# EAGLE design powerboard_monitor (EAGLE 8.4.3)
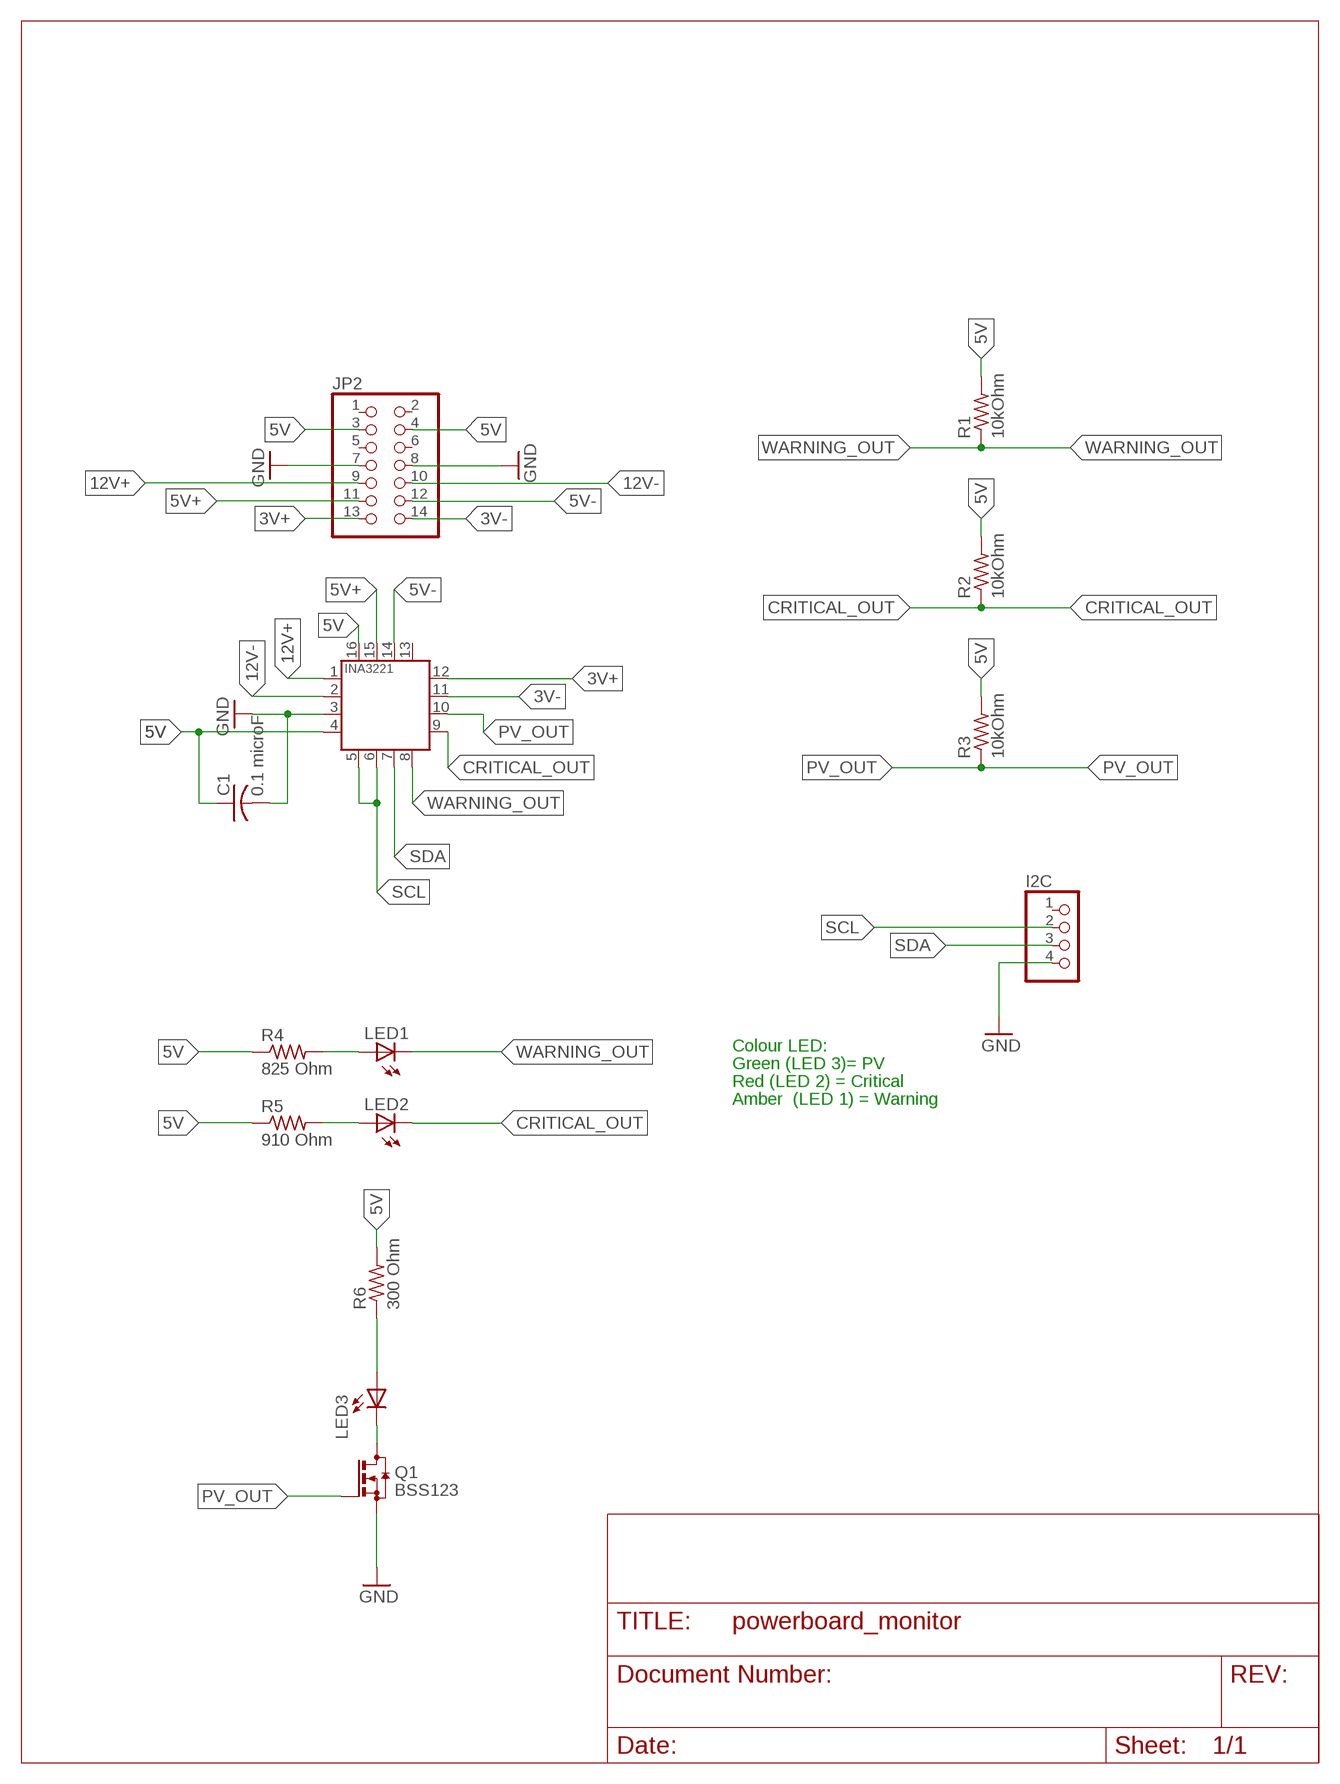
[diagram p0: schematic, sheet 1]

## Parts
C1  0.1 microF  C-USC1206  [C1206]
I2C  PINHD-1X4  [1X04]
JP2  PINHD-2X7  [2X07]
LED1  LEDSMT1206  [1206]
LED2  LEDSMT1206  [1206]
LED3  LEDSMT1206  [1206]
Q1  BSS123  [SOT23]
R1  10kOhm  R-US_R1206  [R1206]
R2  10kOhm  R-US_R1206  [R1206]
R3  10kOhm  R-US_R1206  [R1206]
R4  825 Ohm  R-US_R1206  [R1206]
R5  910 Ohm  R-US_R1206  [R1206]
R6  300 Ohm  R-US_R1206  [R1206]
U1  INA3221.  [HVQFN16_4X4]

## Nets
3V+: JP2.13 U1.12(IN+1)
3V-: JP2.14 U1.11(IN-1)
5V: C1.1 JP2.3 JP2.4 R1.2 R2.2 R3.2 R4.1 R5.1 R6.2 U1.4(VS) U1.16(VPU)
5V+: JP2.11 U1.15(IN+2)
5V-: JP2.12 U1.14(IN-2)
12V+: JP2.9 U1.1(IN-3)
12V-: JP2.10 U1.2(IN+3)
CRITICAL_OUT: LED2.C R2.1 U1.9(CRITICAL)
GND: C1.2 I2C.4 JP2.7 JP2.8 Q1.2(S) U1.3(GND)
N$1: LED3.A R6.1
N$2: LED3.C Q1.3(D)
N$4: LED1.A R4.2
N$5: LED2.A R5.2
PV_OUT: Q1.1(G) R3.1 U1.10(PV)
SCL: I2C.2 U1.5(A0) U1.6(SCL)
SDA: I2C.3 U1.7(SDA)
WARNING_OUT: LED1.C R1.1 U1.8(WARNING)
Unconnected: I2C.1 JP2.1 JP2.2 JP2.5 JP2.6 U1.13(TC)

## Notes on the sheet
- Colour LED:
- Green (LED 3)= PV
- Red (LED 2) = Critical
- Amber  (LED 1) = Warning

## Library data of the parts
C1 = resistor:C-US: CAPACITOR, American symbol
I2C = pinhead:PINHD-1X4: PIN HEADER
JP2 = pinhead:PINHD-2X7: PIN HEADER
LED1-LED3 = led:LED: LED OSRAM: - CHIPLED LG R971, LG N971, LY N971, LG Q971, LY Q971, LO R971, LY R971 LH N974, LH R974 LS Q976, LO Q976, LY Q976 LO Q996 - Hyper CHIPLED LW Q18S LB Q993, LB Q99A, LB R99A - SideLED LS A670, LO A670, LY A670, LG A670, LP A670 LB A673, LV A673, LT A673, LW A673 LH A674 LY A675 LS A676, LA A676, LO A676, LY A676, LW A676 LS A679, LY A679, LG A679 - Hyper Micro SIDELED® LS Y876, LA Y876, LO Y876, LY Y876 LT Y87S - SmartLED LW L88C, LW L88S LB L89C, LB L89S, LG L890 LS L89K, LO L89K, LY L89K LS L896, LA L896, LO L896, LY L896 - TOPLED LS T670, LO T670, LY T670, LG T670, LP T670 LSG T670, LSP T670, LSY T670, LOP T670, LYG T670 LG T671, LOG T671, LSG T671 LB T673, LV T673, LT T673, LW T673 LH T674 LS T676, LA T676, LO T676, LY T676, LB T676, LH T676, LSB T676, LW T676 LB T67C, LV T67C, LT T67C, LS T67K, LO T67K, LY T67K, LW E67C LS E67B, LA E67B, LO E67B, LY E67B, LB E67C, LV E67C, LT E67C LW T67C LS T679, LY T679, LG T679 LS T770, LO T770, LY T770, LG T770, LP T770 LB T773, LV T773, LT T773, LW T773 LH T774 LS E675, LA E675, LY E675, LS T675 LS T776, LA T776, LO T776, LY T776, LB T776 LHGB T686 LT T68C, LB T68C - Hyper Mini TOPLED® LB M676 - Mini TOPLED Santana® LG M470 LS M47K, LO M47K, LY M47K Source: http://www.osram.convergy.de LUXEON: - LUMILED® LXK2-PW12-R00, LXK2-PW12-S00, LXK2-PW14-U00, LXK2-PW14-V00 LXK2-PM12-R00, LXK2-PM12-S00, LXK2-PM14-U00 LXK2-PE12-Q00, LXK2-PE12-R00, LXK2-PE12-S00, LXK2-PE14-T00, LXK2-PE14-U00 LXK2-PB12-K00, LXK2-PB12-L00, LXK2-PB12-M00, LXK2-PB14-N00, LXK2-PB14-P00, LXK2-PB14-Q00 LXK2-PR12-L00, LXK2-PR12-M00, LXK2-PR14-Q00, LXK2-PR14-R00 LXK2-PD12-Q00, LXK2-PD12-R00, LXK2-PD12-S00 LXK2-PH12-R00, LXK2-PH12-S00 LXK2-PL12-P00, LXK2-PL12-Q00, LXK2-PL12-R00 Source: www.luxeon.com KINGBRIGHT: KA-3528ASYC Source: www.kingbright.com
Q1 = transistor-small-signal:BSS123: N-CHANNEL MOS FET
R1-R6 = resistor:R-US_: RESISTOR, American symbol
U1 = New Power Board Library:INA3221: The INA3221 is a three-channel, high-side current and bus voltage monitor with an I 2C- and SMBUScompatible interface. The INA3221 monitors both shunt voltage drops and bus supply voltages, in addition to having programmable conversion times and averaging modes for these signals. The INA3221 offers both critical and warning alerts to detect multiple programmable out-of-range conditions for each channel.

## Board
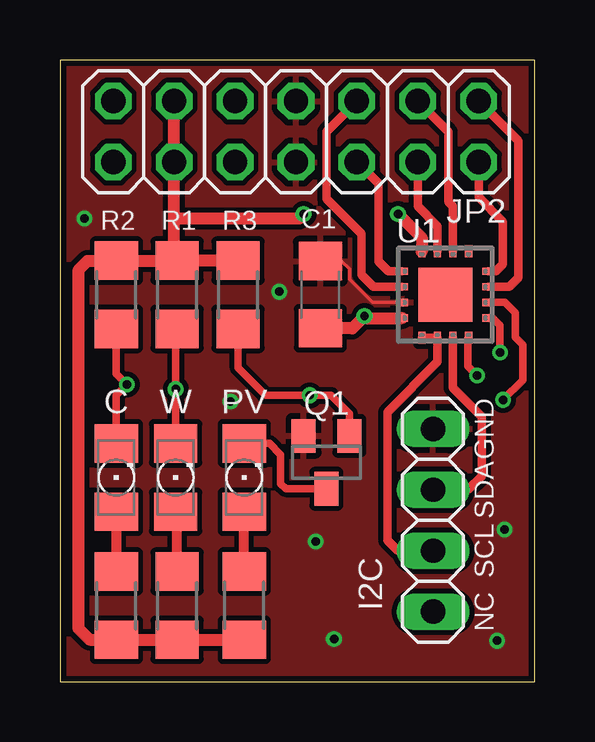
[diagram p1: board, top side]
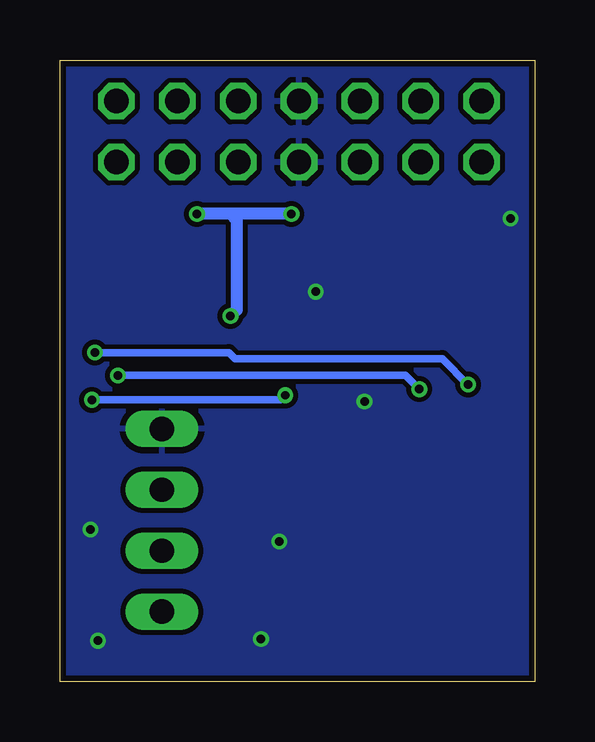
[diagram p2: board, bottom side, seen from below]

Size 19.81 x 25.91 mm. Coordinates in mm from the lower left corner, seen from the top.
Outline: 0,0 19.81,0 19.81,25.91 0,25.91 0,0
Copper layers (1*16): Top 0.035mm / dielectric 1.5mm / Bottom 0.035mm
Design rules "ITEADstudioDRC": minimum track width 6mil, minimum drill 12mil, track to track 8mil, track to pad 8mil, pad to pad 8mil, via to via 8mil, smd to smd 0mil, copper to edge 10mil, drill to drill 10mil, minimum pad ring 6mil, minimum via ring 6mil, stop-mask expansion 2mil, vias tented up to drill 100mil, thermal gap 10mil

### Footprints (pad centres in the part's own frame; a part is rotated, then mirrored left to right if it is on the bottom)
C1206 = smd 1.6 x 1.8: 1 -1.4,0; 2 1.4,0
1X04 = drill 1.016 long: 1 -3.81,0; 2 -1.27,0; 3 1.27,0; 4 3.81,0
2X07 = drill 1.016 octagon: 1 -7.62,-1.27; 2 -7.62,1.27; 3 -5.08,-1.27; 4 -5.08,1.27; 5 -2.54,-1.27; 6 -2.54,1.27; 7 0,-1.27; 8 0,1.27; 9 2.54,-1.27; 10 2.54,1.27; 11 5.08,-1.27; 12 5.08,1.27; 13 7.62,-1.27; 14 7.62,1.27
1206 = smd 1.6 x 1.803: A -1.422,0; C 1.422,0
SOT23 = smd 1 x 1.4: 1 -0.95,-1.1; 2 0.95,-1.1; 3 0,1.1
R1206 = smd 1.6 x 1.803: 1 -1.422,0; 2 1.422,0
HVQFN16_4X4 = smd 0.5 x 0.3: 1 -1.8,0.975; 2 -1.8,0.325; 3 -1.8,-0.325; 4 -1.8,-0.975; 9 1.8,-0.975; 10 1.8,-0.325; 11 1.8,0.325; 12 1.8,0.975 | smd 0.3 x 0.5: 5 -0.975,-1.8; 6 -0.325,-1.8; 7 0.325,-1.8; 8 0.975,-1.8; 13 0.975,1.8; 14 0.325,1.8; 15 -0.325,1.8; 16 -0.975,1.8 | smd 2.25 x 2.25: TH 0,0

### Placement (x,y rotation side)
C1  10.86,16.13 90 top
I2C  15.56,6.73 90 top
JP2  9.84,22.92 0 top
LED1  4.83,8.51 90 top
LED2  2.35,8.51 90 top
LED3  7.68,8.51 90 top
Q1  11.11,9.14 180 top
R1  4.89,16.13 90 top
R2  2.35,16.13 90 top
R3  7.43,16.13 90 top
R4  4.89,3.17 90 top
R5  2.35,3.17 90 top
R6  7.68,3.17 270 top
U1  16.07,16.13 0 top
U$1  [LETTER_P]  -82.55,-130.05 0 top  (outside the outline)
U$2  [DOCFIELD]  1.27,-130.05 0 top  (outside the outline)

### Tracks (layer width: path | path; a pad name or v marks a point on that pad's centre or on a via)
3V+
  Top 0.356: JP2.13 17.46,20.19 18.48,19.18 18.48,17.4 18.18,17.1 U1.12
3V-
  Top 0.356: JP2.14 19.11,22.54 19.11,16.83 18.74,16.45 U1.11
5V  (via drill 0.35)
  Top 0.508: JP2.4 JP2.3 4.76,19.3 | R1.2 R3.2 7.45,17.53 | R6.2 R4.1 R5.1 1.23,1.75 0.76,2.22 0.76,17.14 1.14,17.53 2.33,17.53 R2.2 R1.2 | R1.2 4.76,17.68 4.76,19.3 | v14.1,19.49 15.09,18.5 U1.16 | U1.4 12.79,15.15 v12.7,15.24 12.19,14.73 C1.1 | 4.76,19.3 9.97,19.3 v10.16,19.49
  Bottom 0.508: v10.16,19.49 12.7,19.49 | 12.7,19.49 v14.1,19.49 | 12.7,19.49 12.45,19.24 12.45,15.49 v12.7,15.24
5V+
  Top 0.356: JP2.11 14.92,19.81 15.75,18.99 U1.15
5V-
  Top 0.356: JP2.12 16.19,22.92 16.19,20 16.39,19.8 U1.14
12V+
  Top 0.356: JP2.9 13.27,20.77 13.27,17.53 13.69,17.1 U1.1
12V-
  Top 0.356: U1.2 13.07,16.45 12.57,16.95 12.57,18.67 11.11,20.13 11.11,22.92 JP2.10
CRITICAL_OUT  (via drill 0.35)
  Top 0.305: U1.9 18.06,15.15 18.35,14.86 v18.35,13.72 | R2.1 2.35,12.83 v2.79,12.38 2.35,11.94 LED2.C
  Bottom 0.305: v18.35,13.72 12.76,13.72 12.51,13.46 3.87,13.46 v2.79,12.38
GND  (via drill 0.35)
  Top 0.152: U1.3 13.03,15.8 12.06,16.76 12.06,17.21 11.74,17.53 C1.2
  other vias: 1.02,19.3 10.67,5.84 18.54,6.35 11.43,1.78 18.22,1.71 9.14,16.26 7.11,11.68
  pour Top: -0.25,26.16 20.07,26.16 20.07,-0.51 -0.25,-0.51
  pour Bottom: -0.76,26.92 20.83,26.92 20.83,-0.76 20.57,-1.02 -1.02,-1.02 -1.27,-0.76 -1.27,26.42
N$1
  Top 0.406: R6.1 LED3.A
N$2
  Top 0.305: LED3.C 8.74,9.93 9.21,9.46 9.21,8.26 9.42,8.04 Q1.3
N$4
  Top 0.406: R4.2 4.89,7.02
  Top 0.508: 4.89,7.02 LED1.A
N$5
  Top 0.406: LED2.A R5.2
PV_OUT  (via drill 0.35)
  Top 0.305: U1.10 18.55,15.8 18.99,15.37 18.99,14.35 19.3,14.03 19.3,12.57 v18.48,11.75 | R3.1 7.43,13.08 8.57,11.94 v10.41,11.94 11.3,11.94 12.06,11.18 Q1.1
  Bottom 0.305: v18.48,11.75 10.6,11.75 v10.41,11.94
SCL
  Top 0.356: U1.5 U1.6 15.74,13.33 13.65,11.24 13.65,5.91 14.1,5.46 I2C.2
SDA
  Top 0.356: U1.7 16.39,12.25 17.59,11.05 17.59,8.57 17.02,8 I2C.3
WARNING_OUT  (via drill 0.35)
  Top 0.305: U1.8 17.02,14.31 17.02,13.14 v17.4,12.76 | R1.1 4.83,14.64 v4.83,12.19 LED1.C
  Bottom 0.305: v17.4,12.76 5.4,12.76 v4.83,12.19

### Text on the board
tNames: C | W | PV | GND | SDA | SCL | NC